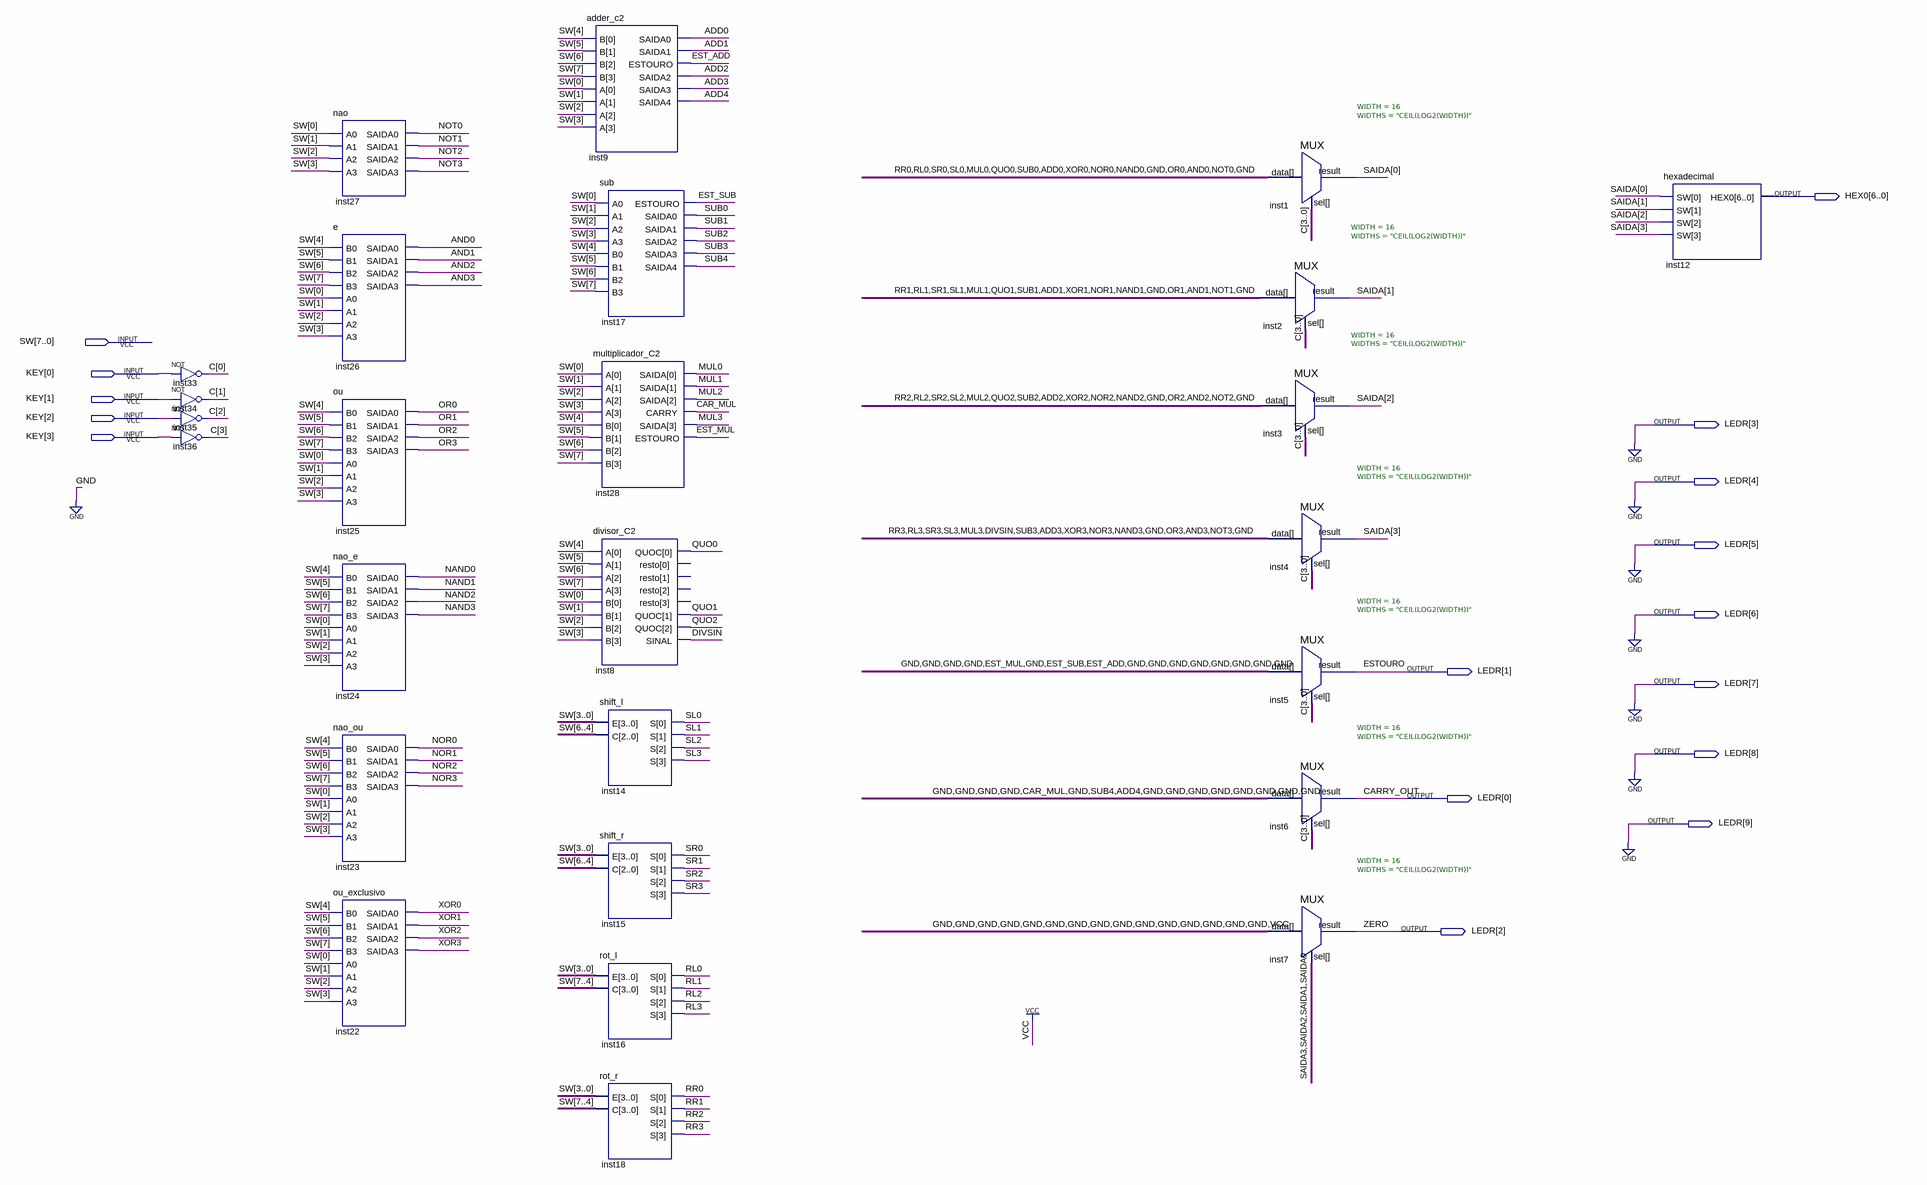
[diagram p0: schematic sheet]
// Quartus schematic ula.bdf as structural Verilog: 26 symbols, 16 pins
module ula (
  input  [7:0] SW,
  input  [3:0] KEY,
  output [6:0] HEX0,
  output [9:0] LEDR
);

  wire ADD0, ADD1, ADD2, ADD3, ADD4, AND0, AND1, AND2, AND3, CAR_MUL, DIVSIN, EST_ADD, EST_MUL, EST_SUB,
       MUL0, MUL1, MUL2, MUL3, NAND0, NAND1, NAND2, NAND3, NOR0, NOR1, NOR2, NOR3, NOT0, NOT1, NOT2, NOT3,
       OR0, OR1, OR2, OR3, QUO0, QUO1, QUO2, RL0, RL1, RL2, RL3, RR0, RR1, RR2, RR3, SL0, SL1, SL2, SL3, SR0,
       SR1, SR2, SR3, SUB0, SUB1, SUB2, SUB3, SUB4, XOR0, XOR1, XOR2, XOR3;
  wire [3:0] C, SAIDA;

  not inst33 (C[0], KEY[0]);
  not inst34 (C[1], KEY[1]);
  not inst35 (C[2], KEY[2]);
  not inst36 (C[3], KEY[3]);
  nao inst27 (
    .A0(SW[0]), .A1(SW[1]), .A2(SW[2]), .A3(SW[3]), .SAIDA0(NOT0), .SAIDA1(NOT1), .SAIDA2(NOT2), .SAIDA3(NOT3));
  e inst26 (
    .B0(SW[4]), .B1(SW[5]), .B2(SW[6]), .B3(SW[7]), .A0(SW[0]), .A1(SW[1]), .A2(SW[2]), .A3(SW[3]),
    .SAIDA0(AND0), .SAIDA1(AND1), .SAIDA2(AND2), .SAIDA3(AND3));
  ou inst25 (
    .B0(SW[4]), .B1(SW[5]), .B2(SW[6]), .B3(SW[7]), .A0(SW[0]), .A1(SW[1]), .A2(SW[2]), .A3(SW[3]),
    .SAIDA0(OR0), .SAIDA1(OR1), .SAIDA2(OR2), .SAIDA3(OR3));
  nao_e inst24 (
    .B0(SW[4]), .B1(SW[5]), .B2(SW[6]), .B3(SW[7]), .A0(SW[0]), .A1(SW[1]), .A2(SW[2]), .A3(SW[3]),
    .SAIDA0(NAND0), .SAIDA1(NAND1), .SAIDA2(NAND2), .SAIDA3(NAND3));
  nao_ou inst23 (
    .B0(SW[4]), .B1(SW[5]), .B2(SW[6]), .B3(SW[7]), .A0(SW[0]), .A1(SW[1]), .A2(SW[2]), .A3(SW[3]),
    .SAIDA0(NOR0), .SAIDA1(NOR1), .SAIDA2(NOR2), .SAIDA3(NOR3));
  ou_exclusivo inst22 (
    .B0(SW[4]), .B1(SW[5]), .B2(SW[6]), .B3(SW[7]), .A0(SW[0]), .A1(SW[1]), .A2(SW[2]), .A3(SW[3]),
    .SAIDA0(XOR0), .SAIDA1(XOR1), .SAIDA2(XOR2), .SAIDA3(XOR3));
  adder_c2 inst9 (
    .B(SW[7:4]), .A(SW[3:0]), .SAIDA0(ADD0), .SAIDA1(ADD1), .ESTOURO(EST_ADD), .SAIDA2(ADD2), .SAIDA3(ADD3),
    .SAIDA4(ADD4));
  sub inst17 (
    .A0(SW[0]), .A1(SW[1]), .A2(SW[2]), .A3(SW[3]), .B0(SW[4]), .B1(SW[5]), .B2(SW[6]), .B3(SW[7]),
    .ESTOURO(EST_SUB), .SAIDA0(SUB0), .SAIDA1(SUB1), .SAIDA2(SUB2), .SAIDA3(SUB3), .SAIDA4(SUB4));
  multiplicador_C2 inst28 (
    .A(SW[3:0]), .B(SW[7:4]), .SAIDA({MUL3, MUL2, MUL1, MUL0}), .CARRY(CAR_MUL), .ESTOURO(EST_MUL));
  divisor_C2 inst8 (.A(SW[7:4]), .B(SW[3:0]), .QUOC({QUO2, QUO1, QUO0}), .SINAL(DIVSIN));  // open: resto
  shift_l inst14 (.E(SW[3:0]), .C(SW[6:4]), .S({SL3, SL2, SL1, SL0}));
  shift_r inst15 (.E(SW[3:0]), .C(SW[6:4]), .S({SR3, SR2, SR1, SR0}));
  rot_l inst16 (.E(SW[3:0]), .C(SW[7:4]), .S({RL3, RL2, RL1, RL0}));
  rot_r inst18 (.E(SW[3:0]), .C(SW[7:4]), .S({RR3, RR2, RR1, RR0}));
  MUX #(.WIDTH(16), .WIDTHS("CEIL(LOG2(WIDTH))")) inst1 (
    .data({RR0, RL0, SR0, SL0, MUL0, QUO0, SUB0, ADD0, XOR0, NOR0, NAND0, 1'b0, OR0, AND0, NOT0, 1'b0}),
    .sel(C), .result(SAIDA[0]));
  MUX #(.WIDTH(16), .WIDTHS("CEIL(LOG2(WIDTH))")) inst2 (
    .data({RR1, RL1, SR1, SL1, MUL1, QUO1, SUB1, ADD1, XOR1, NOR1, NAND1, 1'b0, OR1, AND1, NOT1, 1'b0}),
    .sel(C), .result(SAIDA[1]));
  MUX #(.WIDTH(16), .WIDTHS("CEIL(LOG2(WIDTH))")) inst3 (
    .data({RR2, RL2, SR2, SL2, MUL2, QUO2, SUB2, ADD2, XOR2, NOR2, NAND2, 1'b0, OR2, AND2, NOT2, 1'b0}),
    .sel(C), .result(SAIDA[2]));
  MUX #(.WIDTH(16), .WIDTHS("CEIL(LOG2(WIDTH))")) inst4 (
    .data({RR3, RL3, SR3, SL3, MUL3, DIVSIN, SUB3, ADD3, XOR3, NOR3, NAND3, 1'b0, OR3, AND3, NOT3, 1'b0}),
    .sel(C), .result(SAIDA[3]));
  MUX #(.WIDTH(16), .WIDTHS("CEIL(LOG2(WIDTH))")) inst5 (
    .data({4'b0000, EST_MUL, 1'b0, EST_SUB, EST_ADD, {8{1'b0}}}), .sel(C), .result(LEDR[1]));
  MUX #(.WIDTH(16), .WIDTHS("CEIL(LOG2(WIDTH))")) inst6 (
    .data({4'b0000, CAR_MUL, 1'b0, SUB4, ADD4, {8{1'b0}}}), .sel(C), .result(LEDR[0]));
  MUX #(.WIDTH(16), .WIDTHS("CEIL(LOG2(WIDTH))")) inst7 (.data(16'b0000000000000001), .sel(SAIDA), .result(LEDR[2]));
  hexadecimal inst12 (.SW(SAIDA), .HEX0(HEX0));

  assign LEDR[9:3] = {7{1'b0}};

  // Other names for the same wires on the sheet: CARRY_OUT = LEDR[0]; ESTOURO = LEDR[1]; ZERO = LEDR[2]
endmodule
